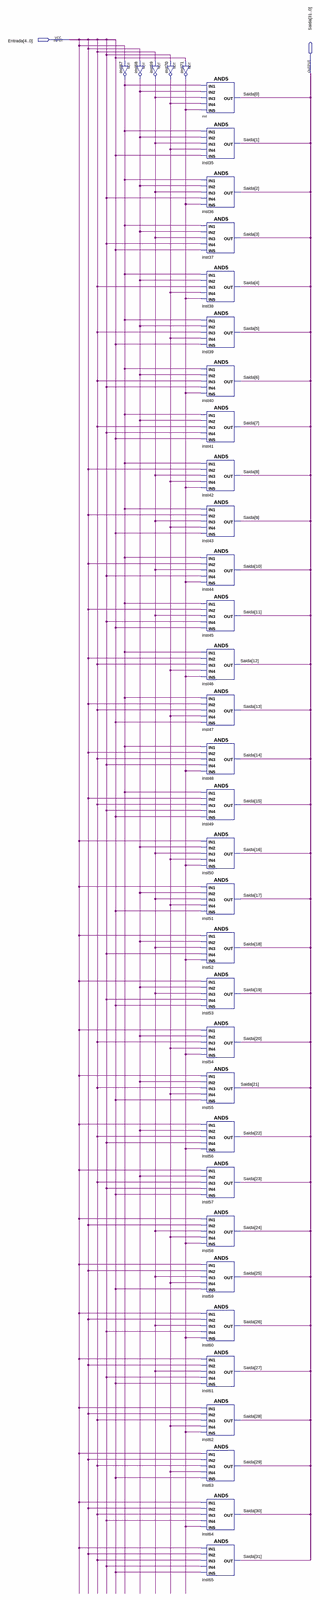
[diagram p0: schematic sheet, whole]
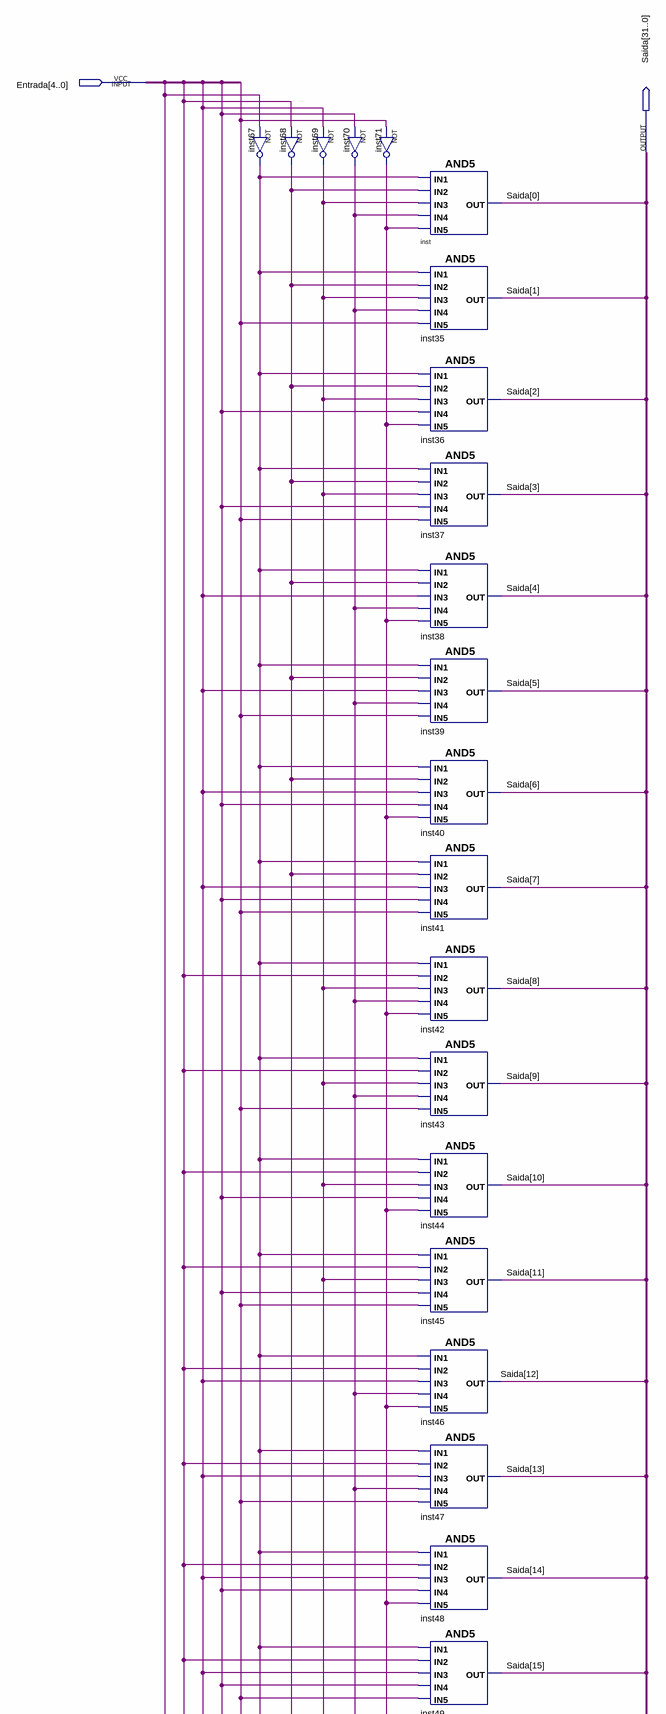
[diagram p1: schematic sheet, upper part]
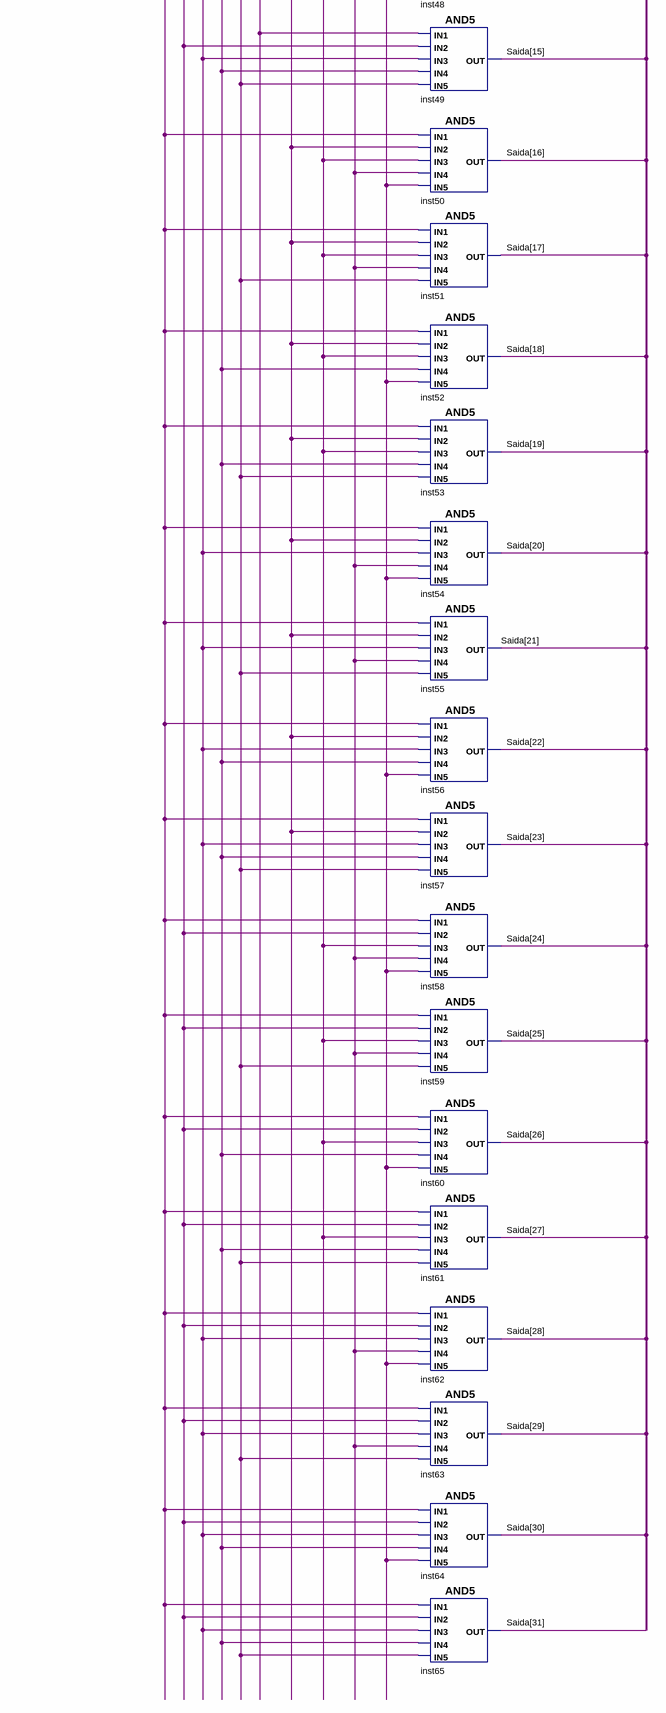
[diagram p2: schematic sheet, lower part]
// Quartus schematic Seletor.bdf as structural Verilog: 37 symbols, 2 pins
module Seletor (
  input  [4:0] Entrada,
  output [31:0] Saida
);

  wire inst67_out, inst68_out, inst69_out, inst70_out, inst71_out;

  not inst67 (inst67_out, Entrada[4]);
  not inst68 (inst68_out, Entrada[3]);
  not inst69 (inst69_out, Entrada[2]);
  not inst70 (inst70_out, Entrada[1]);
  not inst71 (inst71_out, Entrada[0]);
  and inst (Saida[0], inst67_out, inst68_out, inst69_out, inst70_out, inst71_out);
  and inst35 (Saida[1], inst67_out, inst68_out, inst69_out, inst70_out, Entrada[0]);
  and inst36 (Saida[2], inst67_out, inst68_out, inst69_out, Entrada[1], inst71_out);
  and inst37 (Saida[3], inst67_out, inst68_out, inst69_out, Entrada[1], Entrada[0]);
  and inst38 (Saida[4], inst67_out, inst68_out, Entrada[2], inst70_out, inst71_out);
  and inst39 (Saida[5], inst67_out, inst68_out, Entrada[2], inst70_out, Entrada[0]);
  and inst40 (Saida[6], inst67_out, inst68_out, Entrada[2], Entrada[1], inst71_out);
  and inst41 (Saida[7], inst67_out, inst68_out, Entrada[2], Entrada[1], Entrada[0]);
  and inst42 (Saida[8], inst67_out, Entrada[3], inst69_out, inst70_out, inst71_out);
  and inst43 (Saida[9], inst67_out, Entrada[3], inst69_out, inst70_out, Entrada[0]);
  and inst44 (Saida[10], inst67_out, Entrada[3], inst69_out, Entrada[1], inst71_out);
  and inst45 (Saida[11], inst67_out, Entrada[3], inst69_out, Entrada[1], Entrada[0]);
  and inst46 (Saida[12], inst67_out, Entrada[3], Entrada[2], inst70_out, inst71_out);
  and inst47 (Saida[13], inst67_out, Entrada[3], Entrada[2], inst70_out, Entrada[0]);
  and inst48 (Saida[14], inst67_out, Entrada[3], Entrada[2], Entrada[1], inst71_out);
  and inst49 (Saida[15], inst67_out, Entrada[3], Entrada[2], Entrada[1], Entrada[0]);
  and inst50 (Saida[16], Entrada[4], inst68_out, inst69_out, inst70_out, inst71_out);
  and inst51 (Saida[17], Entrada[4], inst68_out, inst69_out, inst70_out, Entrada[0]);
  and inst52 (Saida[18], Entrada[4], inst68_out, inst69_out, Entrada[1], inst71_out);
  and inst53 (Saida[19], Entrada[4], inst68_out, inst69_out, Entrada[1], Entrada[0]);
  and inst54 (Saida[20], Entrada[4], inst68_out, Entrada[2], inst70_out, inst71_out);
  and inst55 (Saida[21], Entrada[4], inst68_out, Entrada[2], inst70_out, Entrada[0]);
  and inst56 (Saida[22], Entrada[4], inst68_out, Entrada[2], Entrada[1], inst71_out);
  and inst57 (Saida[23], Entrada[4], inst68_out, Entrada[2], Entrada[1], Entrada[0]);
  and inst58 (Saida[24], Entrada[4], Entrada[3], inst69_out, inst70_out, inst71_out);
  and inst59 (Saida[25], Entrada[4], Entrada[3], inst69_out, inst70_out, Entrada[0]);
  and inst60 (Saida[26], Entrada[4], Entrada[3], inst69_out, Entrada[1], inst71_out);
  and inst61 (Saida[27], Entrada[4], Entrada[3], inst69_out, Entrada[1], Entrada[0]);
  and inst62 (Saida[28], Entrada[4], Entrada[3], Entrada[2], inst70_out, inst71_out);
  and inst63 (Saida[29], Entrada[4], Entrada[3], Entrada[2], inst70_out, Entrada[0]);
  and inst64 (Saida[30], Entrada[4], Entrada[3], Entrada[2], Entrada[1], inst71_out);
  and inst65 (Saida[31], Entrada[4], Entrada[3], Entrada[2], Entrada[1], Entrada[0]);
endmodule
